# Altium schematic sheet ESP32.SchDoc
size A4; SheetNumber: 1; SheetTotal: 2
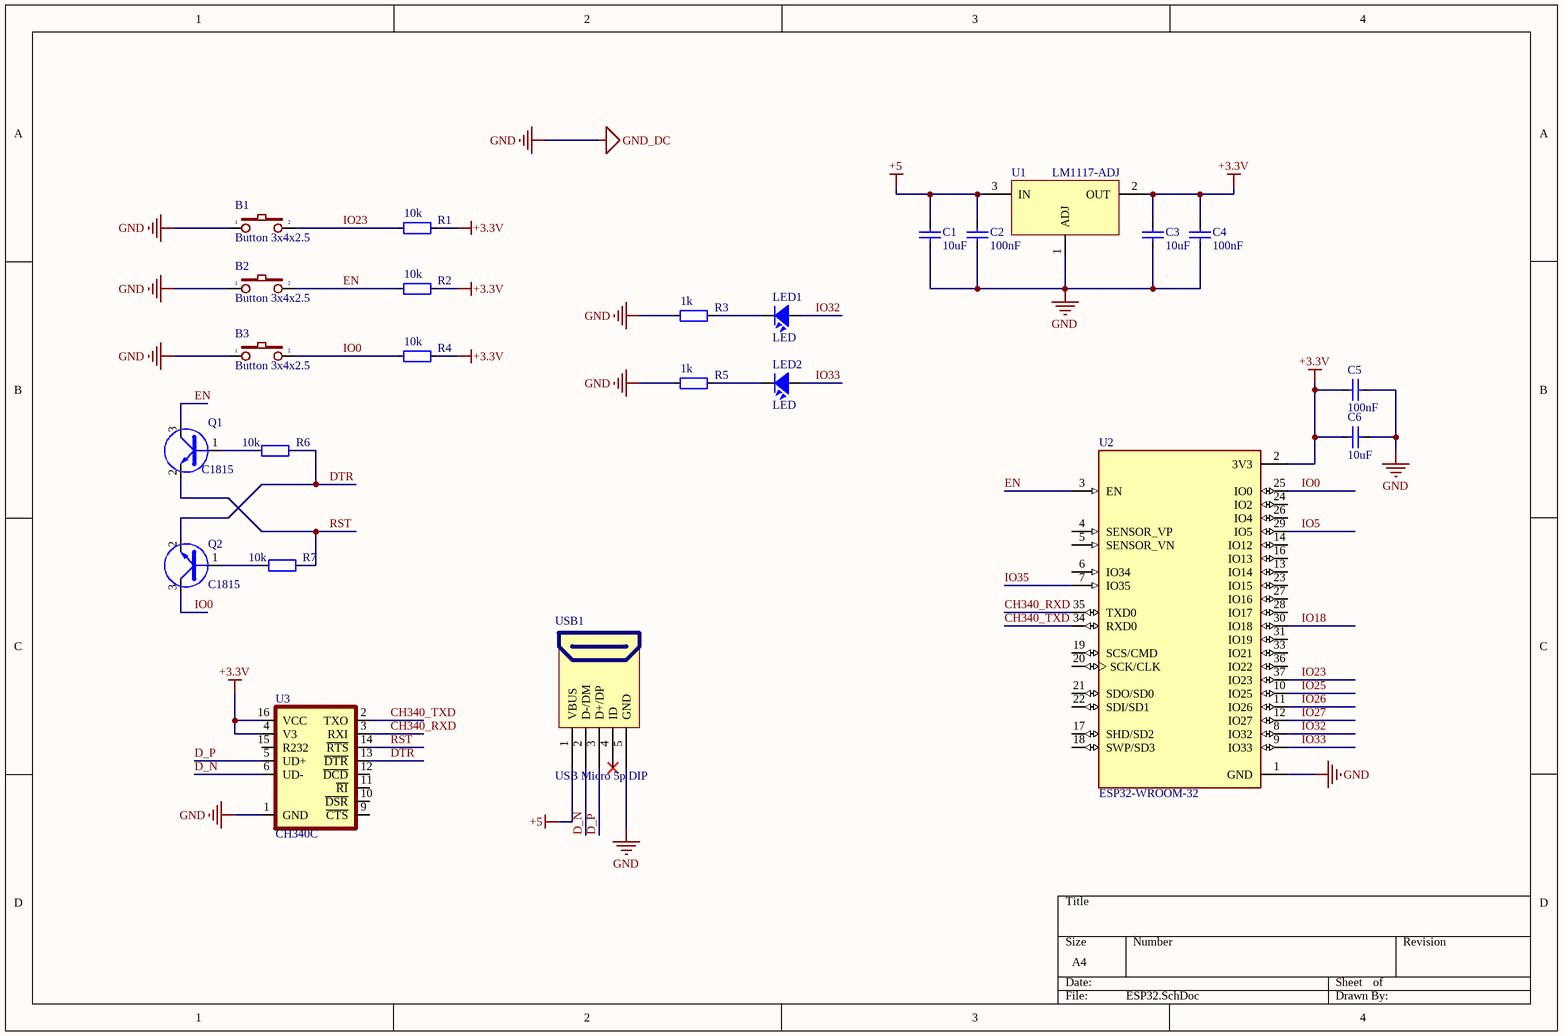
[diagram p0: ESP32.SchDoc]

## Parts
B1  Button 3x4x2.5  [Button 3x4x2.5]
B2  Button 3x4x2.5  [Button 3x4x2.5]
B3  Button 3x4x2.5  [Button 3x4x2.5]
C1  10uF  [CAP_0805]
C2  100nF  [CAP_0805]
C3  10uF  [CAP_0805]
C4  100nF  [CAP_0805]
C5  100nF  [CAP_0805]
C6  10uF  [CAP_0805]
LED1  LED  [LED-0805-Red]
LED2  LED  [LED-0805-Red]
Q1  C1815  [SOT23D]
Q2  C1815  [SOT23D]
R1  10k  [RES-SMD-0805]
R2  10k  [RES-SMD-0805]
R3  1k  [RES-SMD-0805]
R4  10k  [RES-SMD-0805]
R5  1k  [RES-SMD-0805]
R6  10k  [RES-SMD-0805]
R7  10k  [RES-SMD-0805]
U1  LM1117-ADJ  [LM1117-SOP]
U2  ESP32-WROOM-32  [MODULE_ESP32-WROOM-32]
U3  CH340C  [SO016]
USB1  USB Micro 5p DIP  [USB Micro 5p DIP]

## Nets
+3.3V: C3.1 C4.1 C5.1 C6.1 R1.1 R2.1 R4.1 U1.2(OUT) U2.2(3V3) U3.4(V3) U3.16(VCC)
+5: C1.1 C2.1 U1.3(IN) USB1.1(VBUS)
GND: B1.1 B2.1 B3.1 C1.2 C2.2 C3.2 C4.2 C5.2 C6.2 R3.2 R5.2 U1.1(ADJ) U2.1(GND) U3.1(GND) USB1.5(GND)  [also labelled GND_DC]
CH340_RXD: U2.35(TXD0) U3.3(RXI)
CH340_TXD: U2.34(RXD0) U3.2(TXO)
D_N: U3.6(UD-) USB1.2(D-/DM)
D_P: U3.5(UD+) USB1.3(D+/DP)
DTR: Q2.2(E) R6.1 U3.13(~{DTR})
EN: B2.2 Q1.3(C) R2.2 U2.3(EN)
IO0: B3.2 Q2.3(C) R4.2 U2.25(IO0)
IO5: U2.29(IO5)
IO18: U2.30(IO18)
IO23: B1.2 R1.2 U2.37(IO23)
IO25: U2.10(IO25)
IO26: U2.11(IO26)
IO27: U2.12(IO27)
IO32: LED1.1 U2.8(IO32)
IO33: LED2.1 U2.9(IO33)
IO35: U2.7(IO35)
RST: Q1.2(E) R7.1 U3.14(~{RTS})
NetLED1_2: LED1.2 R3.1
NetLED2_2: LED2.2 R5.1
NetQ1_1: Q1.1(B) R6.2
NetQ2_1: Q2.1(B) R7.2

Not connected (* = marked no-connect by the designer): U2 4(SENSOR_VP) 5(SENSOR_VN) 6(IO34) 13(IO14) 14(IO12) 16(IO13) 17(SHD/SD2) 18(SWP/SD3) 19(SCS/CMD) 20(SCK/CLK) 21(SDO/SD0) 22(SDI/SD1) 23(IO15) 24(IO2) 26(IO4) 27(IO16) 28(IO17) 31(IO19) 33(IO21) 36(IO22); U3 9(~{CTS}) 10(~{DSR}) 11(~{RI}) 12(~{DCD}) 15(R232); USB1 4(ID)*

## Library data of the parts
C1-C6 = CapSMD: Capacitor; Value: 33p; Published: 8-Jun-2000; LatestRevisionDate: 17-Jul-2002; LatestRevisionNote: Re-released for DXP Platform.; PackageReference: RAD-0.3; Publisher: Altium Limited
LED1 LED2 = LED: LED Single colour Green and Red; Value: LED 3 ly Single Colour
Q1 Q2 = 2SC1815: NPN 600mW, ECB; Value: C1815
R1-R7 = Resistor - SMD: Resistor; Manufacturer: Generic Components; Class: Passive; Published: 08/06/2000; Publisher: Altium Hobart Technology Centre
U1 = LM1117-ADJ: 800mA Low-Dropout Linear Regulator; Creator: Nguyen Ba Bien; Website: http://group3i.net
U2 = ESP32-WROOM-32: Bluetooth, WiFi Transceiver Module 2.4GHz ~ 2.5GHz Surface Mount; MF: Espressif Systems; Package: Module Espressif Systems; Digi-Key_Part_Number: 1904-1010-1-ND; Digi-Key_Purchase_URL: https://www.digikey.com/product-detail/en/espressif-systems/ESP32-WROOM-32/1904-1010-1-ND/8544305?utm_source=snapeda&utm_medium=aggregator&utm_campaign=symbol; Value: *; MP: ESP32-WROOM-32; SnapEDA_Link: https://www.snapeda.com/parts/ESP32-WROOM-32/Espressif%20Systems/view-part/2753322/?ref=snap
U3 = CH340C: USB to serial chip CH340; MF: WCH; Package: Package; Check_prices: https://www.snapeda.com/parts/CH340C/WCH/view-part/5428851/?ref=eda; Value: *; Price: None; MP: CH340C; Availability: Unavailable; SnapEDA_Link: https://www.snapeda.com/parts/CH340C/WCH/view-part/5428851/?ref=snap
USB1 = USB Micro 5p DIP: USB Type B; Ten: MicroUSB MK5P DIP; Ma_Hang: MH005145